# EAGLE design Adafruit Feather 32u4 FONA (EAGLE 6.6.0)
COMPANY: ADAFRUIT INDUSTRIES; DRAWN: KTOWN; REV: B
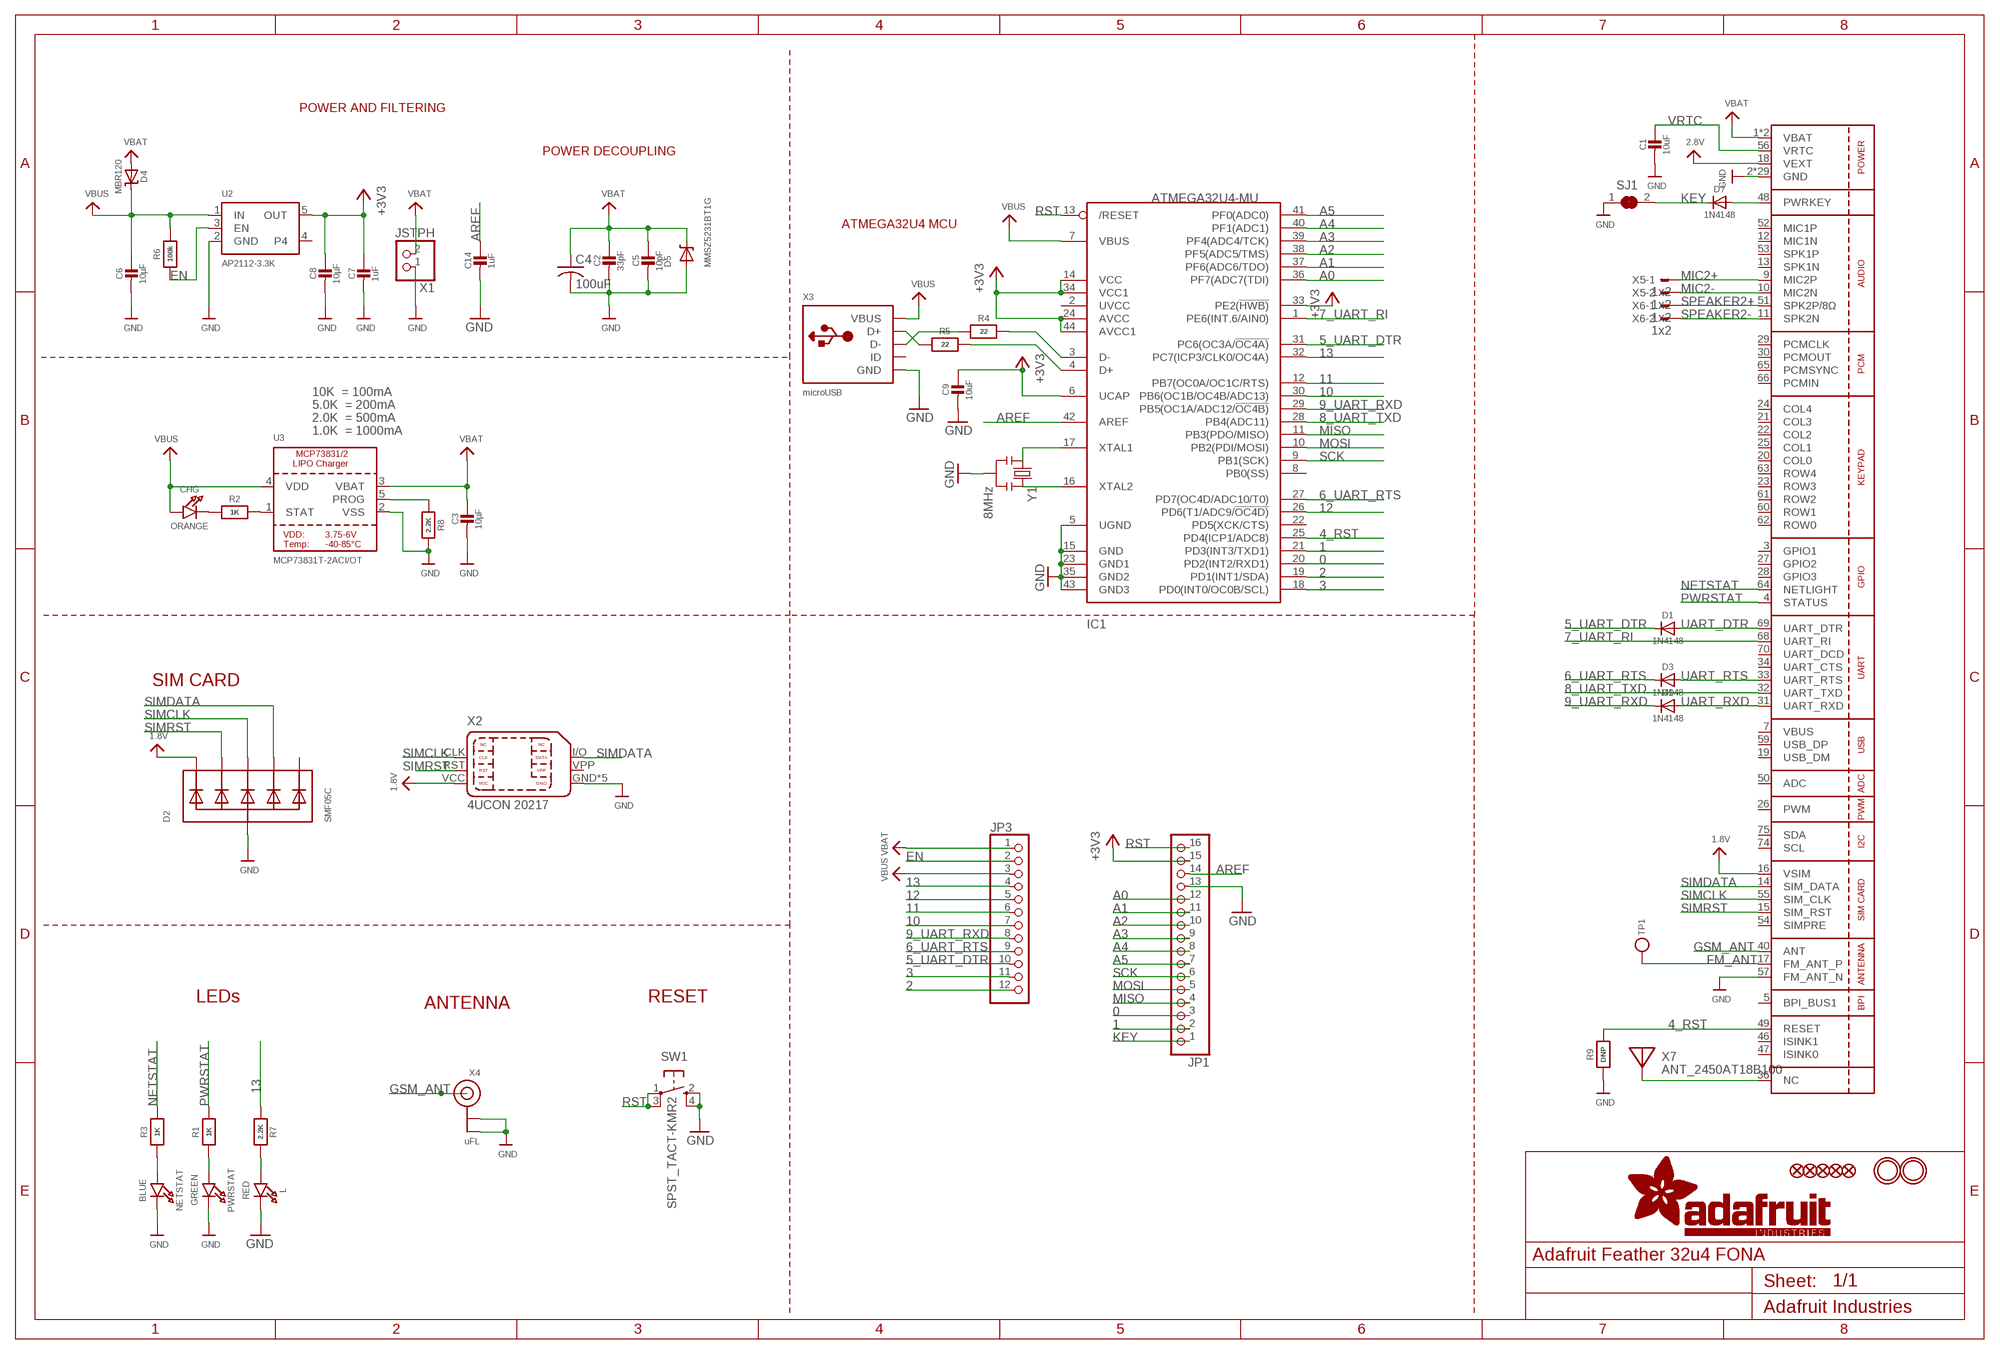
[diagram p0: schematic, sheet 1]

## Parts
C1  10uF  CAP_CERAMIC_0805MP  [_0805MP]
C2  33pF  CAP_CERAMIC0805-NOOUTLINE  [0805-NO]
C3  10µF  CAP_CERAMIC0805-NOOUTLINE  [0805-NO]
C4  100uF  C-USC1210  [C1210]
C5  10pF  CAP_CERAMIC0805-NOOUTLINE  [0805-NO]
C6  10µF  CAP_CERAMIC0805-NOOUTLINE  [0805-NO]
C7  1uF  CAP_CERAMIC0603_NO  [0603-NO]
C8  10µF  CAP_CERAMIC0805-NOOUTLINE  [0805-NO]
C9  10uF  CAP_CERAMIC_0805MP  [_0805MP]
C14  1uF  CAP_CERAMIC0603_NO  [0603-NO]
CHG  ORANGE  LED0805_NOOUTLINE  [CHIPLED_0805_NOOUTLINE]
D1  1N4148  DIODESOD-323  [SOD-323]
D2  SMF05C  TVSARRAY_5LANE  [SOT363]
D3  1N4148  DIODESOD-323  [SOD-323]
D4  MBR120  DIODE-SCHOTTKYSOD-123  [SOD-123]
D5  MMSZ5231BT1G  DIODE-ZENERSOD123  [SOD-123]
D7  1N4148  DIODESOD-323  [SOD-323]
D9  1N4148  DIODESOD-323  [SOD-323]
IC1  ATMEGA32U4-MU  [TQFN44_7MM]
JP1  HEADER-1X16ROUND  [1X16_ROUND]
JP3  HEADER-1X12  [1X12_ROUND]
L  RED  LED0805_NOOUTLINE  [CHIPLED_0805_NOOUTLINE]
NETSTAT  BLUE  LED0805_NOOUTLINE  [CHIPLED_0805_NOOUTLINE]
PWRSTAT  GREEN  LED0805_NOOUTLINE  [CHIPLED_0805_NOOUTLINE]
R1  1K  RESISTOR_0603_NOOUT  [0603-NO]
R2  1K  RESISTOR_0603_NOOUT  [0603-NO]
R3  1K  RESISTOR_0603_NOOUT  [0603-NO]
R4  22  RESISTOR_0603_NOOUT  [0603-NO]
R5  22  RESISTOR_0603_NOOUT  [0603-NO]
R6  100k  RESISTOR_0603_NOOUT  [0603-NO]
R7  2.2K  RESISTOR_0603_NOOUT  [0603-NO]
R8  2.2K  RESISTOR_0603_NOOUT  [0603-NO]
R9  DNP  RESISTOR_0603_NOOUT  [0603-NO]
SJ1  SOLDERJUMPER_CLOSED  [SOLDERJUMPER_CLOSEDWIRE]
SW1  SPST_TACT-KMR2  [KMR2]
TP1  TESTPOINTROUND1.5MM  [TESTPOINT_ROUND_1.5MM]
U1  SIM800H/L  GSM_SIM800L  [SIM800L]
U2  AP2112-3.3K  VREG_SOT23-5  [SOT23-5]
U3  MCP73831T-2ACI/OT  MCP73831/2  [SOT23-5]
U$18  FIDUCIAL""  [FIDUCIAL_1MM]
U$23  FIDUCIAL""  [FIDUCIAL_1MM]
U$31  MOUNTINGHOLE2.5  [MOUNTINGHOLE_2.5_PLATED]
U$32  MOUNTINGHOLE2.5  [MOUNTINGHOLE_2.5_PLATED]
U$34  FIDUCIAL""  [FIDUCIAL_1MM]
U$35  FIDUCIAL""  [FIDUCIAL_1MM]
U$42  FIDUCIAL""  [FIDUCIAL_1MM]
X1  JSTPH  CON_JST_PH_2PIN  [JSTPH2]
X2  4UCON 20217  SIM_MICRO  [4UCONN_20217]
X3  microUSB  USB_MICRO_20329_V2  [4UCONN_20329_V2]
X4  uFL  ANTENNA_U.FL  [U.FL]
X5  1x2  87758-0216  [87758-0216]
X6  1x2  87758-0216  [87758-0216]
X7  ANT_2450AT18B100  ANTENNA_JOHANSON_2450AT18B100  [ANT_2450AT18B100]
Y1  8MHz  RESONATORSMD  [RESONATOR-SMD]

## Nets
0: IC1.20(PD2(INT2/RXD1)) JP1.3
1: IC1.21(PD3(INT3/TXD1)) JP1.2
1.8V: D2.1(C1) U1.16(VSIM) X2.VCC
2: IC1.19(PD1(INT1/SDA)) JP3.12
2.8V: U1.18(VEXT)
3: IC1.18(PD0(INT0/OC0B/SCL)) JP3.11
4_RST: IC1.25(PD4(ICP1/ADC8)) R9.2 U1.49(RESET)
5_UART_DTR: D1.C IC1.31(PC6(OC3A/!OC4A)) JP3.10
6_UART_RTS: D3.C IC1.27(PD7(OC4D/ADC10/T0)) JP3.9
7_UART_RI: IC1.1(PE6(INT.6/AIN0)) U1.68(UART_RI)
8_UART_TXD: IC1.28(PB4(ADC11)) U1.32(UART_TXD)
9_UART_RXD: D9.C IC1.29(PB5(OC1A/ADC12/!OC4B)) JP3.8
10: IC1.30(PB6(OC1B/OC4B/ADC13)) JP3.7
11: IC1.12(PB7(OC0A/OC1C/RTS)) JP3.6
12: IC1.26(PD6(T1/ADC9/!OC4D)) JP3.5
13: IC1.32(PC7(ICP3/CLK0/OC4A)) JP3.4 R7.1
+3V3: C7.1 C8.1 C9.1 IC1.6(UCAP) IC1.14(VCC) IC1.24(AVCC) IC1.33(PE2(!HWB)) IC1.34(VCC1) IC1.44(AVCC1) JP1.15 U2.5(OUT)
A0: IC1.36(PF7(ADC7(TDI)) JP1.12
A1: IC1.37(PF6(ADC6/TDO)) JP1.11
A2: IC1.38(PF5(ADC5/TMS)) JP1.10
A3: IC1.39(PF4(ADC4/TCK)) JP1.9
A4: IC1.40(PF1(ADC1)) JP1.8
A5: IC1.41(PF0(ADC0)) JP1.7
AREF: C14.1 IC1.42(AREF) JP1.14
D+: IC1.4(D+) R5.2
D-: IC1.3(D-) R4.2
EN: JP3.2 R6.1 U2.3(EN)
FM_ANT: TP1.P$1 U1.17(FM_ANT_P)
GND: C1.2 C2.2 C3.2 C4.2 C5.2 C6.2 C7.2 C8.2 C9.2 C14.2 D2.2(A) D5.A IC1.5(UGND) IC1.15(GND) IC1.23(GND1) IC1.35(GND2) IC1.43(GND3) JP1.13 L.C NETSTAT.C PWRSTAT.C R8.2 R9.1 SJ1.1 SW1.2(S) SW1.4(S1) U1.2(GND) U1.6(GND) U1.8(GND) U1.35(GND) U1.37(GND) U1.38(GND) U1.39(GND) U1.41(GND) U1.43(GND) U1.44(GND) U1.45(GND) U1.57(FM_ANT_N) U1.58(GND) U1.67(GND) U1.71(GND) U1.72(GND) U1.73(GND) U1.76(GND) U1.77(GND) U1.78(GND) U1.79(GND) U1.80(GND) U1.81(GND) U1.82(GND) U1.83(GND) U1.84(GND) U1.85(GND) U1.86(GND) U1.87(GND) U1.88(GND) U2.2(GND) U3.2(VSS) X1.1 X2.GND X2.GND@1(GND) X2.GND@2(GND) X2.GND@3(GND) X2.GND@4(GND) X3.BASE@1(GND) X3.BASE@2(GND) X3.GND X3.SPRT@1(GND) X3.SPRT@2(GND) X3.SPRT@3(GND) X3.SPRT@4(GND) X4.1(GND) X4.2(GND) Y1.2
GSM_ANT: U1.40(ANT) X4.3(SIGNAL)
KEY: D7.C JP1.1 SJ1.2
MIC2+: U1.9(MIC2P) X5.1
MIC2-: U1.10(MIC2N) X5.2
MISO: IC1.11(PB3(PDO/MISO)) JP1.4
MOSI: IC1.10(PB2(PDI/MOSI)) JP1.5
N$1: CHG.C R2.1
N$2: L.A R7.2
N$3: R2.2 U3.1(STAT)
N$4: R8.1 U3.5(PROG)
N$5: PWRSTAT.A R1.1
N$6: U1.36(NC) X7.FP
N$7: D7.A U1.48(PWRKEY)
N$9: NETSTAT.A R3.1
N$11: IC1.16(XTAL2) Y1.3
N$12: IC1.17(XTAL1) Y1.1
N$15: R5.1 X3.D+
N$16: R4.1 X3.D-
NETSTAT: R3.2 U1.64(NETLIGHT)
PWRSTAT: R1.2 U1.4(STATUS)
RST: IC1.13(/RESET) JP1.16 SW1.1(P) SW1.3(P1)
SCK: IC1.9(PB1(SCK)) JP1.6
SIMCLK: D2.4(C3) U1.55(SIM_CLK) X2.CLK
SIMDATA: D2.5(C4) U1.14(SIM_DATA) X2.I/O(DATA)
SIMRST: D2.3(C2) U1.15(SIM_RST) X2.RST
SPEAKER2+: U1.51(SPK2P/8Ω) X6.1
SPEAKER2-: U1.11(SPK2N) X6.2
UART_DTR: D1.A U1.69(UART_DTR)
UART_RTS: D3.A U1.33(UART_RTS)
UART_RXD: D9.A U1.31(UART_RXD)
VBAT: C2.1 C3.1 C4.1 C5.1 D4.A D5.C JP3.1 U1.1(VBAT) U1.42(VBAT) U3.3(VBAT) X1.2
VBUS: C6.1 CHG.A D4.C IC1.7(VBUS) JP3.3 R6.2 U2.1(IN) U3.4(VDD) X3.VBUS
VRTC: C1.1 U1.56(VRTC)
Unconnected: D2.6(C5) IC1.2(UVCC) IC1.8(PB0(SS)) IC1.22(PD5(XCK/CTS)) U1.3(GPIO1) U1.5(BPI_BUS1) U1.12(MIC1N) U1.13(SPK1N) U1.19(USB_DM) U1.20(COL0) U1.21(COL3) U1.22(COL2) U1.23(ROW3) U1.24(COL4) U1.25(COL1) U1.26(PWM) U1.27(GPIO2) U1.28(GPIO3) U1.29(PCMCLK) U1.30(PCMOUT) U1.34(UART_CTS) U1.46(ISINK1) U1.47(ISINK0) U1.50(ADC) U1.52(MIC1P) U1.53(SPK1P) U1.54(SIMPRE) U1.59(USB_DP) U1.60(ROW1) U1.61(ROW2) U1.62(ROW0) U1.63(ROW4) U1.65(PCMSYNC) U1.66(PCMIN) U1.70(UART_DCD) U1.74(SCL) U1.75(SDA) U2.4 X2.VPP X3.ID

## Notes on the sheet
- POWER AND FILTERING
- POWER DECOUPLING
- ATMEGA32U4 MCU
- 10K  = 100mA
- 5.0K  = 200mA
- 2.0K  = 500mA
- 1.0K  = 1000mA
- SIM CARD
- LEDs | ANTENNA | RESET

## Power pins joined to a net without a drawn wire
VBUS: U1.7(VBUS)

## Library data of the parts
C1-C3 C5-C9 C14 = microbuilder:CAP_CERAMIC: Ceramic Capacitors For new designs, use the packages preceded by an '_' character since they are more reliable: The following footprints should be used on most boards: _0402 - Standard footprint for regular board layouts _0603 - Standard footprint for regular board layouts _0805 - Standard footprint for regular board layouts _1206 - Standard footprint for regular board layouts For extremely tight-pitch boards where space is at a premium, the following 'micro-pitch' footprints can be used (smaller pads, no silkscreen outline, etc.): _0402MP - Micro-pitch footprint for very dense/compact boards _0603MP - Micro-pitch footprint for very dense/compact boards _0805MP - Micro-pitch footprint for very dense/compact boards _1206MP - Micro-pitch footprint for very dense/compact boards
C4 = rcl:C-US: CAPACITOR, American symbol
CHG L NETSTAT PWRSTAT = microbuilder:LED: LED 0603 - 0603 Surface Mount Package 2mA: Green LED - Low Power (3.9mcd, 2ma, 1.7Vf) - Digikey: 475-2709-2-ND Orange LED - Low Power (9.8mcd, 2ma, 1.8Vf) - Digikey: 475-1194-2-ND Red LED - Low Power (5mcd, 2ma, 1.8Vf) - Digikey: 475-1195-2-ND Yellow LED - Low Power (7mcd, 2ma, 1.8Vf) - Digikey: 475-1196-2-ND 5mA: Blue LED - Low Power (17mcd, 5ma, 2.9Vf) - Digikey: LNJ937W8CRACT-ND 0805 - 0805 Surface Mount Package 2mA: Red LED (8.8mcd, 2mA, 1.8Vf, Clear) - Low Power [Digikey: 475-2510-1-ND] Green LED (5mcd, 2mA, 1.8Vf, Clear) - Low Power [Digikey: 475-2730-1-ND] Yellow LED (11.3mcd, 2mA, 1.8Vf, Clear) - Low Power [Digikey: 475-2555-1-ND] 20mA: Red LED (104mcd, 20mA, Diffused) - LS R976 [Digikey: 475-1278-6-ND] Red LED (12mcd, 20mA, 2.0Vf, Clear) - APT2012EC [Digikey: 754-1128-1-ND] Green LED (15mcd, 20mA, 2.2Vf, Clear) - APT2012GC [Digikey: 754-1131-1-ND] Orange LED (160mcd, 20mA, 2.1Vf, Clear) - APT2012SECK [Digikey: 754-1130-1-ND] 1206 - 1206 Surface Mount Package Green LED (26mcd, 20mA, Diffused) - LG N971 [Digikey: 475-1407-6-ND] Red LED (15mcd, 20mA, Diffused) - LH N974 [Digikey: 475-1416-6-ND] Cree - Cree High-Power Surface Mount LEDs XPEBWT-L1-0000-00D50 - White 111lm 350mA 2.9Vf 6200K 110° XTEAWT-00-0000-00000LEE3 - White 114lm 350mA 2.85Vf 5000K 115° Everlight - Everlight 45-21 Series Surface Mount LEDs 45-21/QK2C-B2832AC2CB2/2T - Warm White 2000mcd 20mA 3.25Vf 3050K 120° 45-21/LK2C-B38452C4CB2/2T - Nuetral White 2000mcd 20mA 3.25Vf 4150K 120° 45-21/LK2C-B50634C6CB2/2T - Cold White 2200mcd 20mA 3.25Vf 5650K 120° PLCC2 Reverse Mount LS T77K-J1L2-1-0-2-R18-Z - Red 11.25mcd 2mA 1.8Vf 630nm 120° LO T77K-L1M2-24-Z - Orange 19.6mcd 2mA 1.8Vf 606nm 120° LY T77K-K2M1-26-Z - Yellow 15.7mcd 2mA 1.8Vf 587nm 120°
D1 D3 D7 D9 = microbuilder:DIODE: Diode SMA Model Volts Amps Type Vf Ir Digikey # Notes SSA34-E3 40V 3A Schottky 480mV @ 3A 200uA @ 40V SSA34-E3/61TGITR-ND CDBA120-G 20V 1A Schottky 500mV @ 1A 500uA @ 20V 641-1014-6-ND REEL MBRA210 10V 2A Schottky 350mV @ 2A 700uA @ 10V MBRA210LT3 SOD-123 Model Volts Amps Type Vf Ir Order # Notes BAT54T1G 30V 200mA Schottky 800mV @ 200mA 2uA @ 25V BAT54T1GOSTR-ND B0530W 30V 500mA Schottky 430mV @ 500mA 130uA @ 30V B0530W-FDICT-ND REEL MBR120 20V 1A Schottky 340mV @ 1A MBR120VLSFT1GOSCT-ND SOD-323 Model Volts Amps Type Vf Ir Order # Notes PMEG2005EJ 20V 500mA Schottky 355mV @ 500mA 568-4110-1-ND ZLLS410 10V 570mA Schottky 380mV @ 570mA ZLLS410CT-ND 1N4148WS 75V 150mA Silicon/Simple 1V 1N4148WSFSCT-ND REEL SOD-523 Model Volts Amps Type Vf Ir Order # Notes BAT54XV2 30V 200mA Schottky 0.8V @ 100mA BAT54XV2CT-ND TB751S 30V 30mA Schottky RB751S-40TE61CT-ND SOT23-R/W (R = Solder Paste/Reflow Ovens, W = Hand-Soldering) Model Volts Amps Type Vf Ir Order # Notes BAT54FILM 40V 300mA Schottky 497-7162-1-ND POWERDI-5 Model Volts Amps Type Vf Ir Order # Notes PDS560 60V 5A Schottky 670mV @ 5A 150uA @ 60V PDS560DICT-ND
D2 = microbuilder:TVSARRAY_5LANE: Voltage Transient Suppressor Array SOT363 SMF05C - 100W 5V: Digikey - SMF05CT1GOSCT-ND
D4 = microbuilder:DIODE-SCHOTTKY
D5 = microbuilder:DIODE-ZENER: Zener Diode SMA: 30V 1W Zener Diode, 1.2Vf - Digikey: SMAZ30-FDICT-ND
IC1 = microbuilder:ATMEGA32U4: http://www.ladyada.net/library/eagle
JP1 = microbuilder:HEADER-1X16: PIN HEADER
JP3 = microbuilder:HEADER-1X12
R1-R9 = microbuilder:RESISTOR: Resistors For new designs, use the packages preceded by an '_' character since they are more reliable: The following footprints should be used on most boards: _0402 - Standard footprint for regular board layouts _0603 - Standard footprint for regular board layouts _0805 - Standard footprint for regular board layouts _1206 - Standard footprint for regular board layouts For extremely tight-pitch boards where space is at a premium, the following 'micro-pitch' footprints can be used (smaller pads, no silkscreen outline, etc.): _0402MP - Micro-pitch footprint for very dense/compact boards _0603MP - Micro-pitch footprint for very dense/compact boards _0805MP - Micro-pitch footprint for very dense/compact boards _1206MP - Micro-pitch footprint for very dense/compact boards
SJ1 = microbuilder:SOLDERJUMPER_CLOSED: Solder Jumper - Closed These solder jumpers are closed by default CLOSEDWIRE - 10 mil trace between pads that can be cut and resoldered later CLOSEDPERM - 63 mil trace between pads for a permanent connection (used to 'bridge' two signals, a shameless hack for Eagle). Can double as a test point as well (no cream layer)
SW1 = adafruit:SPST_TACT: SMT 6mm switch, EVQQ2 series http://www.ladyada.net/library/eagle
TP1 = microbuilder:TESTPOINT: Test Point Various test points for characterisation and PCB testing TESTPOINT_SMT - Compact Surface Mount Test Point [Digikey: 5016KTR-ND]
U1 = microbuilder:GSM_SIM800L: SIM800K Quad-Band GSM/GPRS Module 850/900/1800/1900 MHz Bluetooth EDR (3.0) FM Band: 76-109MHz (50kHz steps) -40 - 85°C
U2 = microbuilder:VREG_SOT23-5: SOT23-5 Fixed Voltage Regulators Part Current Out V Out V In V Dropout θJA (°C/W) TJ (°C) Digikey Part No. ADP121 150mA 3.3V 3.4-5.5V 0.09V @ 150mA -- -- ADP121-AUJZ33R7CT-ND ADP121 150mA 3.0V 3.1-5.5V 0.09V @ 150mA -- -- ADP121-AUJZ30R7CT-ND ADP122 300mA 3.3V 3.4-5.5V 0.085V @ 300mA -- -- ADP122AUJZ-3.3-R7CT-ND ADP1712 300mA 3.3V 3.5-5.5V 0.17V @ 300mA -- -- ADP1712AUJZ-3.3-R7TR-ND AP7311 (Low Cost) 150mA 3.3V 3.5-6V 0.15V @ 150mA -- -- AP7311-33WG-7DICT-ND LD39015M18R 150mA 1.8V 1.9V-5.5V 0.08V @ 100mA -- -- 497-6977-1-ND LP2985A-33DBVR 150mA 3.3V 3.3-16V 0.28V @ 150mA 206 150 296-18479-1-ND MCP1824T-3302E/OT 300mA 3.3V 3.5V-6V 0.2V @ 300mA -- -- MCP1824T-3302E/OTCT-ND MIC5205-2.5YM5 TR 150mA 2.5V 2.7-16V 0.165V @ 150mA -- -- 576-1257-2-ND MIC5205-3.0YM5 TR 150mA 3.0V 3.2V-16V 0.165V @ 150mA -- -- 576-1258-2-ND MIC5205-3.3YM5 TR 150mA 3.3V 3.5V-16V 0.165V @ 150mA -- -- 576-1259-2-ND TPS780330220 150mA 3.3V+2.2V 3.6-5.5V 250mV Max -- -- 296-23332-1-ND TDA3663/N1,135 100mA 3.3V 3.5-45V 0.18V @ 50mA -- -- 568-5343-1-ND Max operating temp can be calculated using θJA, TJ (max junction temperature), and power in watts. Set the "Maximum Ambient Temperature" until it reaches TJ ("Max Junction Temperature"), which is the absolute limit for safe use of the regulator: Heat Sink Temperature Calculator <http://www.daycounter.com/Calculators/Heat-Sink-Temperature-Calculator.phtml> For example, With 12V source into a 3.3V LP2985 and a 30mA load, we are dissipating (12V-3.3V) * 0.03A = 0.261W. With a θJA of 206 °C/W, a TJ of 150°C, and 261mW we can safely use the chip without a heat sink up to 75°C (=147.1°C Junction Temperature).
U3 = microbuilder:MCP73831/2: MCP73831/2 LIPO Charger VDD: 3.75 - 6V Temp -40 - 85°C Programmable Charge Rate: 15-500mA NOTE: STAT is a tri-state logic output on the MCP73831 and an open-drain output on the MCP73832. SOT23-5 with 4.2V output and tri-state logic on STAT = MCP73831T-2ACI/OT
U$18 U$23 U$34 U$35 U$42 = microbuilder:FIDUCIAL: Fiducial Alignment Points Various fiducial points for machine vision alignment.; BOM: EXCLUDE
U$31 U$32 = microbuilder:MOUNTINGHOLE: Mounting Hole For #2 screws (0.086"/2.18mm width, 0.094"/2.4mm hole) use 2.5mm; BOM: EXCLUDE
X1 = microbuilder:CON_JST_PH_2PIN: JST 2-Pin Right-Angle Connector PH-Series - 4UConnector: 17311 SH-Series - 4UConnector: 07278
X2 = microbuilder:SIM_MICRO: Micro SIM Card Holder 78723-1001 = Molex Push/Pull connector (8-Pin)
X3 = microbuilder:USB: USB Connectors USBMINIB - Surface Mount Female Mini-B USB Connector 4UConnector: 06564
X4 = microbuilder:ANTENNA_U.FL: U.FL Antenna Connector
X5 X6 = con-molex:87758-0216: 2 Pin - 2mm Dual Row Single Wafer, Vertical T/H HDR Source: http://www.molex.com/pdm_docs/sd/877580616_sd.pdf; MPN: 87758-0216; OC_FARNELL: unknown; OC_NEWARK: 94M1513
X7 = microbuilder:ANTENNA_JOHANSON_2450AT18B100: Johanson 2.4GHz Chip Antenna (1206 Package) Frequency Range: 2400 - 2500 Mhz Peak Gain 0.5 dBi typ. (XZ-V) Average Gain -0.5 dBi typ. (XZ-V) Input Power 3W max. Operating Temperature -40 to +85°C Digikey: 712-1006-1-ND
Y1 = SparkFun:RESONATOR: Resonator Small SMD resonator. This is the itty bitty 10/20MHz resonators with built in caps. CSTCE10M0G55 and CSTCE20M0V53. Footprint has been reviewed closely but hasn't been tested yet.

## Board
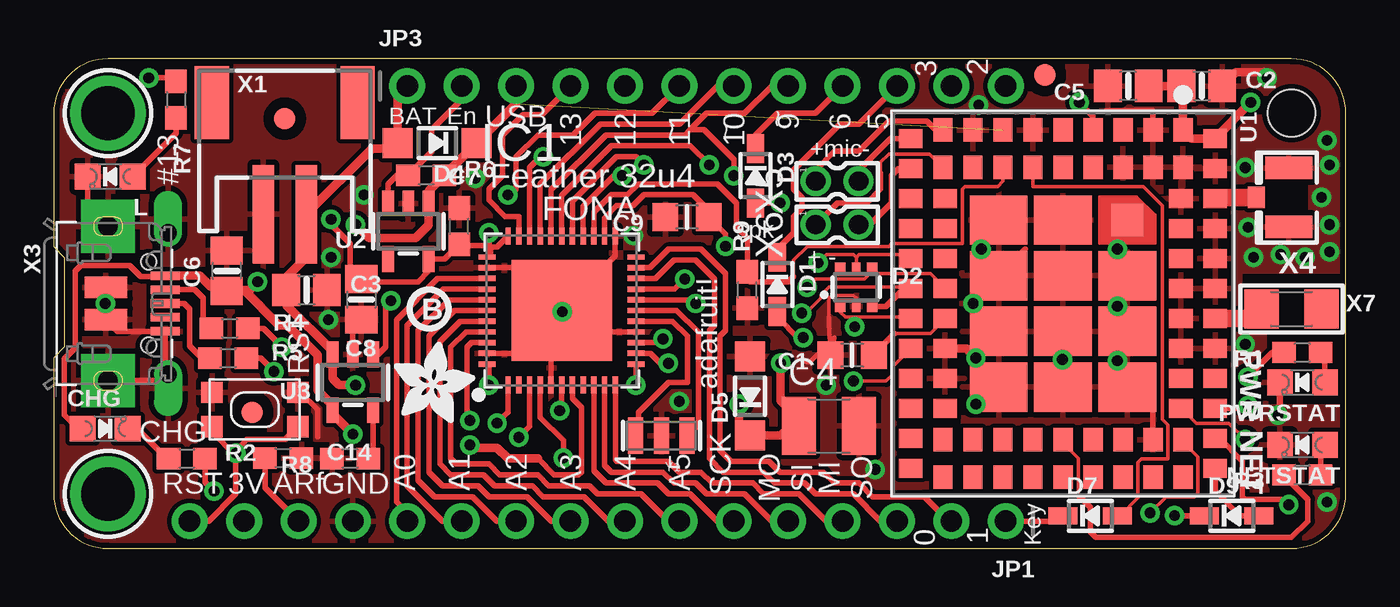
[diagram p1: board, top side]
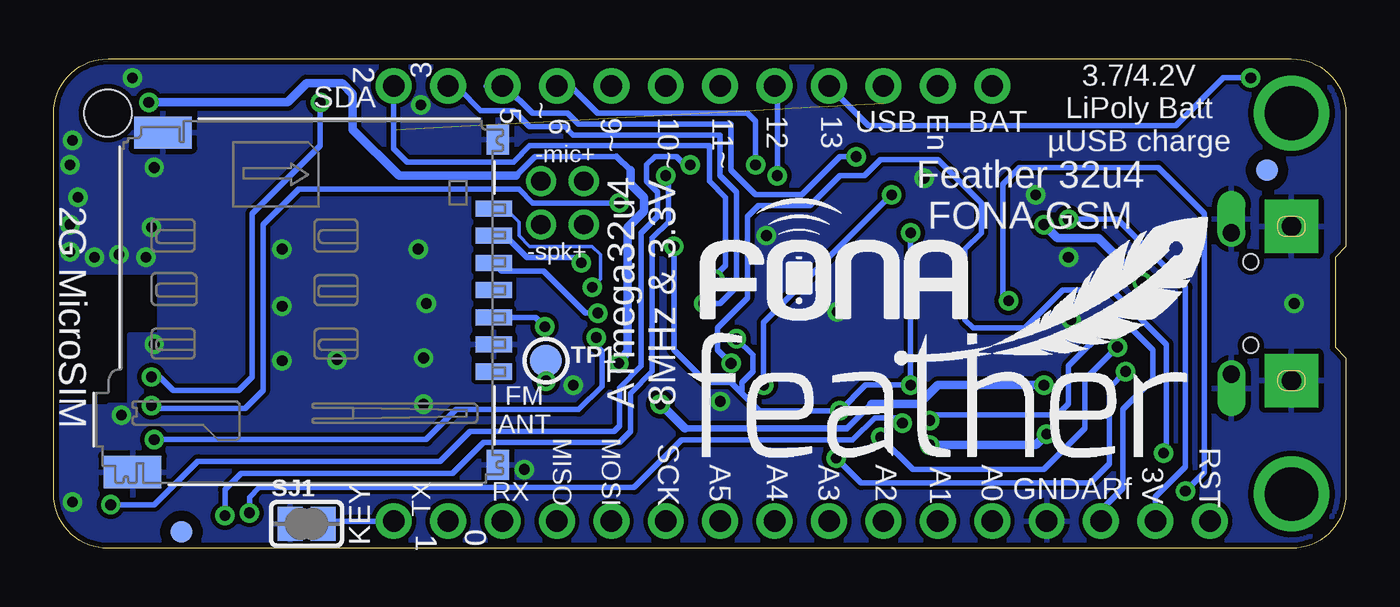
[diagram p2: board, bottom side, seen from below]

Size 60.33 x 22.86 mm. Coordinates in mm from the lower left corner, seen from the top.
Outline: 2.54,0 57.78,0 arc90 60.33,2.54 60.33,20.32 arc90 57.78,22.86 2.54,22.86 arc90 0,20.32 0,14.1 0.51,13.59 0.51,9.4 0,8.89 0,2.54 arc90 2.54,0
Copper layers (1*16): Top 0.035mm / dielectric 1.5mm / Bottom 0.035mm
Design rules "adafruit 6-6 *": minimum track width 6mil, minimum drill 15.5mil, track to track 8mil, track to pad 6mil, pad to pad 8mil, via to via 8mil, smd to smd 8mil, copper to edge 10mil, drill to drill 8mil, minimum pad ring 10mil, minimum via ring 8mil, stop-mask expansion 2mil, vias tented up to drill 20mil, thermal gap 10mil
Holes 2.2 mm at 57.78,20.32
tRestrict: area 23.5,8.1 to 26.4,8.6; area 26.3,8.6 to 26.5,9.9; area 26.3,10.3 to 26.5,13.5; area 21,13.6 to 25.9,14; area 20.8,9.3 to 21.2,12.8; area 21.1,8.1 to 23,8.6; area 20.8,8.4 to 21.2,8.9; area 20.8,13.3 to 21.2,13.7

### Footprints (pad centres in the part's own frame; a part is rotated, then mirrored left to right if it is on the bottom)
_0805MP = smd 1.2 x 1.3: 1 -1.016,0; 2 1.016,0
0805-NO = smd 1.3 x 1.5: 1 -0.95,0; 2 0.95,0
C1210 = smd 1.6 x 2.7: 1 -1.4,0; 2 1.4,0
0603-NO = smd 1.1 x 1: 1 -0.85,0; 2 0.85,0
CHIPLED_0805_NOOUTLINE = smd 1.2 x 1.2: A 0,-1.05; C 0,1.05
SOD-323 = smd 1.35 x 0.8: A 1.27,0; C -1.27,0
SOT363 = smd 0.5 x 0.5: 1 -0.75,-0.9; 3 0.75,-0.9; 4 0.75,0.9; 6 -0.75,0.9 | smd 0.4 x 0.5: 2 0,-0.9; 5 0,0.9
SOD-123 = smd 1.4 x 1.4: A 1.85,0; C -1.85,0
TQFN44_7MM = smd 0.25 x 0.8: 1 -2.5,-3.475; 2 -2,-3.475; 3 -1.5,-3.475; 4 -1,-3.475; 5 -0.5,-3.475; 6 0,-3.475; 7 0.5,-3.475; 8 1,-3.475; 9 1.5,-3.475; 10 2,-3.475; 11 2.5,-3.475; 23 2.5,3.475; 24 2,3.475; 25 1.5,3.475; 26 1,3.475; 27 0.5,3.475; 28 0,3.475; 29 -0.5,3.475; 30 -1,3.475; 31 -1.5,3.475; 32 -2,3.475; 33 -2.5,3.475 | smd 0.8 x 0.25: 12 3.475,-2.5; 13 3.475,-2; 14 3.475,-1.5; 15 3.475,-1; 16 3.475,-0.5; 17 3.475,0; 18 3.475,0.5; 19 3.475,1; 20 3.475,1.5; 21 3.475,2; 22 3.475,2.5; 34 -3.475,2.5; 35 -3.475,2; 36 -3.475,1.5; 37 -3.475,1; 38 -3.475,0.5; 39 -3.475,0; 40 -3.475,-0.5; 41 -3.475,-1; 42 -3.475,-1.5; 43 -3.475,-2; 44 -3.475,-2.5 | smd 4.7 x 4.7: THERMAL 0,0
1X16_ROUND = drill 1 pad 1.676: 1 -19.05,0; 2 -16.51,0; 3 -13.97,0; 4 -11.43,0; 5 -8.89,0; 6 -6.35,0; 7 -3.81,0; 8 -1.27,0; 9 1.27,0; 10 3.81,0; 11 6.35,0; 12 8.89,0; 13 11.43,0; 14 13.97,0; 15 16.51,0; 16 19.05,0
1X12_ROUND = drill 1 pad 1.676: 1 -13.97,0; 2 -11.43,0; 3 -8.89,0; 4 -6.35,0; 5 -3.81,0; 6 -1.27,0; 7 1.27,0; 8 3.81,0; 9 6.35,0; 10 8.89,0; 11 11.43,0; 12 13.97,0
SOLDERJUMPER_CLOSEDWIRE = smd 1.168 x 1.6: 1 -0.762,0; 2 0.762,0 | smd 0.635 x 0.203: WIRE 0,0
KMR2 = smd 1 x 1: 1 2,0.8; 2 2,-0.8; 3 -2,0.8; 4 -2,-0.8
TESTPOINT_ROUND_1.5MM = smd 1.5 x 1.5: P$1 0,0
SIM800L = smd 1.1 x 0.9: 1 -8.1,5.6; 2 -8.1,4.2; 3 -8.1,2.8; 4 -8.1,1.4; 5 -8.1,0; 6 -8.1,-1.4; 7 -8.1,-2.8; 8 -8.1,-4.2; 9 -8.1,-5.6; 22 8.1,-5.6; 23 8.1,-4.2; 24 8.1,-2.8; 25 8.1,-1.4; 26 8.1,0; 27 8.1,1.4; 28 8.1,2.8; 29 8.1,4.2; 30 8.1,5.6; 43 -6.36,5.6; 44 -6.36,4.2; 45 -6.36,2.8; 46 -6.36,1.4; 47 -6.36,0; 48 -6.36,-1.4; 49 -6.36,-2.8; 50 -6.36,-4.2; 51 -6.36,-5.6; 60 6.36,-5.6; 61 6.36,-4.2; 62 6.36,-2.8; 63 6.36,-1.4; 64 6.36,0; 65 6.36,1.4; 66 6.36,2.8; 67 6.36,4.2; 68 6.36,5.6 | smd 0.9 x 1.1: 10 -7.7,-7.1; 11 -6.3,-7.1; 12 -4.9,-7.1; 13 -3.5,-7.1; 14 -2.1,-7.1; 15 -0.7,-7.1; 16 0.7,-7.1; 17 2.1,-7.1; 18 3.5,-7.1; 19 4.9,-7.1; 20 6.3,-7.1; 21 7.7,-7.1; 31 7.7,7.1; 32 6.3,7.1; 33 4.9,7.1; 34 3.5,7.1; 35 2.1,7.1; 36 0.7,7.1; 37 -0.7,7.1; 38 -2.1,7.1; 39 -3.5,7.1; 40 -4.9,7.1; 41 -6.3,7.1; 42 -7.7,7.1; 52 -4.9,-5.5; 53 -3.5,-5.5; 54 -2.1,-5.5; 55 -0.7,-5.5; 56 0.7,-5.5; 57 2.1,-5.5; 58 3.5,-5.5; 59 4.9,-5.5; 69 4.9,5.5; 70 3.5,5.5; 71 2.1,5.5; 72 0.7,5.5; 73 -0.7,5.5; 74 -2.1,5.5; 75 -3.5,5.5; 76 -4.9,5.5 | smd 1.5 x 1.5: 77 -3.9,3 | smd 2.3 x 2.7: 78 -3.9,0; 79 -3.9,-3; 80 -1.3,-3; 81 1.3,-3; 82 3.9,-3; 83 3.9,0; 84 3.9,3; 85 1.3,3; 86 -1.3,3; 87 -1.3,0; 88 1.3,0
SOT23-5 = smd 0.55 x 1.2: 1 -0.95,-1.3; 2 0,-1.3; 3 0.95,-1.3; 4 0.95,1.3; 5 -0.95,1.3
FIDUCIAL_1MM = smd 1 x 1: 1 0,0
MOUNTINGHOLE_2.5_PLATED = drill 2.5 pad 3.2: P$1 0,0
JSTPH2 = smd 1 x 4.6: 1 -1,-3.7; 2 1,-3.7 | smd 1.6 x 3.4: NC1 -3.4,1.5; NC2 3.4,1.5
4UCONN_20217 = smd 0.75 x 1.7: CLK -12.31,16.86; GND -5.96,16.86; I/O -11.04,16.86; RST -9.77,16.86; SW -4.69,16.86; VCC -7.23,16.86; VPP -8.5,16.86 | smd 1.4 x 1.05: GND@1 -15.53,17.06; GND@4 -0.33,17.06 | smd 1.5 x 2.7: GND@2 -15.86,1.42; GND@3 0,0
4UCONN_20329_V2 = smd 1 x 2: BASE@1 -0.75,-2; BASE@2 0.75,-2 | smd 0.4 x 1.35: D+ 0,0.775; D- -0.65,0.775; GND 1.3,0.775; ID 0.65,0.775; VBUS -1.3,0.775 | drill 0.8 pad 1.2 offset: SPRT@1 -3.3,0.9; SPRT@2 3.3,0.9 | drill 0.9 pad 2.5 square: SPRT@3 -3.6,-1.9; SPRT@4 3.6,-1.9 | hole 0.7: -1.95,0; 1.95,0
U.FL = smd 2.2 x 1.05: 1 0,1.375; 2 0,-1.375 | smd 0.8 x 1: 3 1.525,0
87758-0216 = drill 0.9 pad 1.27: 1 0,-1; 2 0,1
ANT_2450AT18B100 = smd 1.6 x 1.8: FP -1.4,0; NC 1.4,0
RESONATOR-SMD = smd 0.7 x 1.7: 1 -1.2,0; 2 0,0; 3 1.2,0

### Placement (x,y rotation side)
C1  37.27,9.02 180 top
C2  53.59,21.59 0 top
C3  11.81,12.06 0 top
C4  36.2,5.71 0 top
C5  50.16,21.59 180 top
C6  8.09,12.96 90 top
C7  18.94,15.04 90 top
C8  14.37,11.62 270 top
C9  29.57,15.46 180 top
C14  10.72,4.22 0 top
CHG  2.41,5.59 270 top
D1  33.78,12.32 270 top
D2  37.47,12.19 0 top
D3  32.77,17.4 270 top
D4  17.91,18.92 180 top
D5  32.51,7.11 90 top
D7  48.39,1.52 0 top
D9  54.99,1.52 0 top
IC1  23.72,11.1 0 top
JP1  25.4,1.27 180 top
JP3  30.48,21.59 0 top
L  2.65,17.36 90 top
NETSTAT  58.29,4.83 90 top
PWRSTAT  58.29,7.75 90 top
R1  58.29,9.14 180 top
R2  6.22,4.19 0 top
R3  58.29,3.43 180 top
R4  8.22,10.27 0 top
R5  8.15,8.88 0 top
R6  17.4,17.42 0 top
R7  5.71,20.95 270 top
R8  13.84,4.19 180 top
R9  32.38,12.06 90 top
SJ1  48.51,1.14 0 bottom
SW1  9.4,6.48 180 top
TP1  37.34,8.76 0 bottom
U1  47.12,11.43 270 top
U2  16.56,14.81 180 top
U3  13.97,7.75 180 top
U$7  [ADAFRUIT_3.5MM]  15.88,5.84 0 top
U$18  9.27,6.35 0 top
U$23  3.68,17.65 0 bottom
U$25  [FEATHERLOGO]  30.73,4.19 0 bottom
U$31  2.54,20.32 270 top
U$32  2.54,2.54 270 top
U$34  10.79,20.07 270 top
U$35  46.28,22.11 270 top
U$42  54.36,0.76 0 bottom
U$43  [FONA_LOGO_SMALL]  30.23,10.54 0 bottom
U$44  [PCBFEAT-REV-040]  17.53,11.18 0 top
X1  10.79,19.3 0 top
X2  56.64,3.56 270 bottom
X3  4.45,11.43 270 top
X4  57.66,16.38 180 top
X5  36.58,17.14 270 top
X6  36.58,15.11 270 top
X7  57.78,11.18 0 top
Y1  28.37,5.26 180 top

### Tracks (layer width: path | path; a pad name or v marks a point on that pad's centre or on a via)
0
  Top 0.254: JP1.3 38.61,1.27 37.34,2.54 35.56,2.54 35.05,3.05 33.66,3.05 33.15,3.56 31.24,3.56 30.61,4.19 30.61,10.16 30.86,10.41 30.86,12.57 29.97,13.46 28.96,13.46 28.1,12.6 IC1.20
1
  Top 0.254: IC1.21 27.83,13.1 28.7,13.97 30.23,13.97 31.37,12.83 31.37,10.16 31.11,9.91 31.11,4.57 31.62,4.06 33.4,4.06 33.91,3.56 35.94,3.56 36.45,3.05 37.59,3.05 38.23,2.41 40.64,2.41 41.78,1.27 JP1.2
1.8V  (via drill 0.5)
  Top 0.152: D2.1 36.72,11.04 36.96,10.79 37.47,10.79 | 37.47,10.79 40.08,10.79 | 37.47,10.79 v37.4,10.35
  Top 0.254: 40.08,10.79 U1.16
  Bottom 0.254: X2.VCC 37.84,10.79 v37.4,10.35
2  (via drill 0.5)
  Top 0.254: IC1.19 28.99,12.1 v29.46,12.57
  Bottom 0.254: 44.58,21.59 JP3.12 44.45,18.67 43.81,18.03 38.86,18.03 38.1,18.8 29.72,18.8 29.72,17.14 28.96,16.38 28.96,13.21 29.46,12.7 v29.46,12.57
3  (via drill 0.5)
  Top 0.254: IC1.18 29.8,11.6 v29.97,11.43
  Bottom 0.254: v29.97,11.43 29.21,11.43 28.45,12.19 28.45,16.64 29.21,17.4 29.21,19.3 36.07,19.3 36.45,19.68 38.1,19.68 38.86,20.45 40.39,20.45 41.4,21.46 41.78,21.46 JP3.11
4_RST
  Top 0.152: 34.54,12.7 34.54,13.46 35.18,14.1 38.99,14.1 39.12,14.22 42.42,14.22 42.42,16.76 42.55,16.89 44.07,16.89 44.32,17.14 U1.49
  Top 0.254: IC1.25 25.22,15.69 26.04,16.51 26.8,16.51 27.3,17.02 30.99,17.02 31.88,16.13 31.88,14.99 32.38,14.48 R9.2 | 32.38,12.83 32.38,12.57 32.51,12.45 34.29,12.45 34.54,12.7
  Top 0.406: R9.2 32.38,12.83
5_UART_DTR  (via drill 0.5)
  Top 0.254: IC1.31 22.22,17.78 22.73,18.29 v22.86,18.29 | JP3.10 37.59,19.81 36.7,19.81 34.54,17.65 34.54,16.76 34.92,16.38 34.92,15.88 34.54,15.49 34.54,14.73 33.78,13.97 D1.C
  Bottom 0.254: v22.86,18.29 23.62,18.29 25.4,16.51 27.56,16.51 28.7,17.65 28.7,19.81 35.81,19.81 36.32,20.32 37.97,20.32 39.24,21.59 JP3.10 40.13,21.59
6_UART_RTS  (via drill 0.5)
  Top 0.254: v27.56,17.91 27.18,18.29 26.29,18.29 24.22,16.22 IC1.27 | JP3.9 35.56,20.32 33.78,20.32 32.77,19.3 D3.C
  Bottom 0.254: JP3.9 36.2,21.59 34.92,20.32 27.94,20.32 27.56,19.94 v27.56,17.91
7_UART_RI  (via drill 0.5)
  Top 0.152: v51.18,1.65 51.94,2.41 53.24,2.41 53.42,2.59 53.42,4.27 52.72,4.96 U1.68
  Top 0.254: IC1.1 21.22,6.34 21.2,6.34 v20.7,5.84
  Bottom 0.254: v20.7,5.84 20.95,6.1 22,6.1 23.04,5.05 31.01,5.05 33.22,2.85 50.72,2.85 51.18,2.39 v51.18,1.65
8_UART_TXD  (via drill 0.5)
  Top 0.254: IC1.28 23.72,16.48 26.04,18.8 29.72,18.8 v30.61,17.91 | U1.32 54.43,5.13 55.5,4.06 55.5,2.41 55.63,2.29 57.28,2.29 57.53,2.03 v57.66,2.03
  Bottom 0.254: v30.61,17.91 30.61,17.65 31.24,18.29 32.26,18.29 32.64,17.91 32.64,17.14 32.13,16.64 32.13,15.49 32.89,14.73 32.89,8.51 33.91,7.49 33.91,5.71 34.16,5.46 40.89,5.46 42.29,4.06 53.59,4.06 55.63,2.03 v57.66,2.03
9_UART_RXD  (via drill 0.5)
  Top 0.254: 29.72,19.56 29.46,19.3 25.78,19.3 23.22,16.74 IC1.29 | 29.72,19.56 30.48,20.32 32.26,20.32 33.53,21.59 JP3.8 | D9.C v52.32,1.52 | v31.75,17.4 31.75,18.16 30.35,19.56 29.72,19.56
  Bottom 0.254: v52.32,1.52 52.32,2.74 51.56,3.5 41.71,3.5 40.26,4.95 33.91,4.95 33.4,5.46 33.4,7.24 32.38,8.26 32.38,14.48 31.62,15.24 31.62,17.27 v31.75,17.4
10
  Top 0.254: JP3.7 30.99,21.59 29.21,19.81 25.53,19.81 22.72,17 IC1.30
11  (via drill 0.5)
  Top 0.254: JP3.6 27.94,20.32 25.27,20.32 24.26,19.3 22.61,19.3 21.59,18.29 21.59,16.76 21.34,16.51 v21.21,16.51 | IC1.12 27.18,8.59 v27.18,7.62
  Bottom 0.254: v21.21,16.51 27.18,10.54 v27.18,7.62
12  (via drill 0.5)
  Top 0.254: v26.54,17.4 26.16,17.4 24.72,15.96 IC1.26
  Bottom 0.254: JP3.5 26.54,21.46 v26.54,17.4
13  (via drill 0.5)
  Top 0.254: JP3.4 22.8,20.26 21.91,20.26 20.95,19.3 20.95,17.4 20.32,16.76 20.32,16.26 21.08,15.49 21.72,15.49 IC1.32 | R7.1 5.55,21.97 v4.45,21.97
  Bottom 0.254: JP3.4 22.29,19.75 7.94,19.75 5.71,21.97 v4.45,21.97
+3V3  (via drill 0.5)
  Top 0.254: IC1.33 20.71,14.07 20.39,14.07 | 20.39,14.07 20.32,14.14 | 20.32,14.14 v20.32,14.73 | IC1.14 28.27,9.6 v28.45,9.78 | IC1.24 25.72,15.43 26.29,16 27.05,16 27.56,16.51 29.84,16.51 30.59,15.77 C9.1 31.37,14.68 v31.37,14.1 | 20.39,14.07 20.39,13.6 IC1.34 | IC1.6 23.72,6.52 v23.62,6.43 | 14.37,12.69 13.84,13.21 13.84,14.22 12.95,15.11 v12.95,15.37 | 14.37,12.69 C8.1 | 20.32,14.14 18.99,14.14 C7.1 18.26,13.51 U2.5 17.51,12.94 17.02,12.45 14.61,12.45 14.37,12.69 | IC1.44 20.32,8.53 v20.32,7.62
  Bottom 0.254: v20.32,14.73 v20.32,7.62 22.43,7.62 v23.62,6.43 27.38,6.43 28.19,7.24 | v28.45,9.78 27.69,9.02 27.69,8.26 28.19,7.75 28.19,7.24 | 28.19,7.24 28.7,7.75 29.84,7.75 31.37,9.27 v31.37,14.1 | JP1.15 8.89,2.41 7.49,3.81 7.49,12.19 10.67,15.37 v12.95,15.37
A0
  Top 0.254: IC1.36 17.94,12.6 16,10.67 16,2.16 16.51,1.65 JP1.12
A1
  Top 0.254: IC1.37 18.2,12.1 16.51,10.41 16.51,2.92 18.16,1.27 JP1.11
A2
  Top 0.254: JP1.10 20.7,1.27 19.56,2.41 17.78,2.41 17.02,3.17 17.02,10.16 18.46,11.6 IC1.38
A3
  Top 0.254: JP1.9 23.24,1.27 22.1,2.41 20.32,2.41 19.81,2.92 18.16,2.92 17.53,3.56 17.53,9.91 18.72,11.1 IC1.39
A4
  Top 0.254: IC1.40 18.98,10.6 18.03,9.65 18.03,3.94 18.54,3.43 20.07,3.43 20.57,2.92 22.35,2.92 22.86,2.41 24.77,2.41 25.91,1.27 JP1.8
A5
  Top 0.254: IC1.41 19.25,10.1 18.54,9.4 18.54,4.19 18.8,3.94 20.32,3.94 20.83,3.43 22.61,3.43 23.11,2.92 25.02,2.92 25.4,2.54 27.43,2.54 28.7,1.27 JP1.7
AREF  (via drill 0.5)
  Top 0.254: IC1.42 19.51,9.6 19.3,9.4 19.3,6.1 v19.43,5.97 | JP1.14 9.87,2.83 C14.1
  Bottom 0.254: JP1.14 11.43,1.78 10.41,2.79 10.41,6.48 9.02,7.87 9.02,9.27 10.16,10.41 11.05,10.41 12.95,8.51 12.95,6.73 13.46,6.22 19.18,6.22 v19.43,5.97
D+  (via drill 0.5)
  Top 0.254: R5.2 9.66,8.88 v10.29,8.26 | IC1.4 22.72,6.11 23.8,5.03 v23.8,4.22
  Bottom 0.254: v23.8,4.22 22.63,3.05 11.94,3.05 11.05,3.94 11.05,7.49 v10.29,8.26
D-  (via drill 0.5)
  Top 0.254: IC1.3 22.22,5.68 v21.72,5.18 | R4.2 9.8,10.27 v10.67,9.4
  Bottom 0.254: v21.72,5.18 20.22,3.68 14.1,3.68 12.19,5.59 12.19,7.87 v10.67,9.4
EN
  Top 0.254: JP3.2 19.05,20.95 17.65,19.56 17.65,18.53 R6.1 16.03,17.42 15.62,17.02 15.62,16.12 U2.3
FM_ANT  (via drill 0.5)
  Top 0.152: U1.17 39.18,8.49 39.18,8.13 38.86,7.81 v37.34,7.81
  Bottom 0.152: v37.34,7.81 TP1.P$1
GND  (via drill 0.5)
  Top 0.152: D2.2 37.47,11.68 37.34,11.81 36.32,11.81 36.2,11.68 36.2,10.79
  Top 0.203: 36.2,10.79 36.2,10.54 C1.2 36.45,9.84 35.31,8.7 35.12,8.7
  Top 0.254: IC1.15 25.08,10.1 23.88,11.3 | IC1.5 23.22,10.52 v23.75,11.05 | IC1.43 22.31,9.1 23.75,10.54 v23.75,11.05 | IC1.35 22.08,13.1 23.88,11.3 | IC1.23 26.22,13.64 23.88,11.3 | L.C 1.59,15.03 X3.SPRT@3 | X3.BASE@2 3,10.13 X3.GND 5.22,8.26 X3.SPRT@2 5.04,7.83 X3.SPRT@4 | 23.88,11.3 23.88,11.18 v23.75,11.05 | U3.2 13.97,10.67 C8.2 | SW1.4 11.52,7.28 12.32,6.48 12.32,5.21 | U1.67 51.32,7.53 U1.84 | 49.15,20.45 51.31,20.45 51.31,19.54 U1.2 | U1.82 43.32,6.73 v43.05,6.73 | U1.80 45.36,13.97
  Top 0.305: 57.24,6.35 PWRSTAT.C
  Top 0.406: C2.2 55.18,22.23 56.52,22.23 | U1.57 42.61,9.33 v43.05,8.89
  other vias: 43.31,13.97 29.21,6.86 38.35,3.68 2.41,11.43 12.95,13.59 27.05,14.61 19.68,17.27 12.83,10.67 14.48,16.51 49.66,8.76 49.66,11.3 49.66,13.97 42.93,11.43 36.07,7.62 59.56,17.91 55.63,17.78 59.56,15.11 56.64,21.97 59.18,16.38 59.44,2.16 57.28,13.72 58.42,13.59 59.56,13.84 59.44,19.05 43.18,20.7 55.63,9.53 47.09,8.81 56.01,13.59 55.75,14.99 57.15,6.22
  pour Top: 0,22.86 0,0 60.45,0 60.45,6.6 56.58,6.6 56.52,9.91 55.37,9.91 55.37,12.95 60.45,12.95 60.45,22.86
  pour Bottom: 0,0 60.71,0 60.83,6.6 57.72,6.6 57.72,6.67 56.77,6.67 56.77,9.97 55.37,9.97 55.37,12.89 60.45,12.89 60.45,22.86 0,22.86
GSM_ANT
  Top 0.254: 54.22,16.38 U1.40
  Top 0.813: X4.3 54.22,16.38
KEY
  Top 0.254: D7.C 46.86,1.27 JP1.1
  Bottom 0.254: SJ1.2 47.62,1.27 JP1.1
MIC2+
  Top 0.254: U1.9 41.18,19.53 40.77,19.94 38.99,19.94 37.59,18.54 36.45,18.54 35.58,17.67 X5.1
MIC2-
  Top 0.254: U1.10 39.07,19.13 37.58,17.64 X5.2
MISO
  Top 0.254: 36.7,1.27 JP1.4 36.07,1.27 34.8,2.54 33.15,2.54 32.64,3.05 30.73,3.05 30.23,3.56 29.21,3.56 28.7,4.06 26.29,4.06 26.23,4.13 IC1.11
MOSI
  Top 0.254: JP1.5 33.53,1.27 32.26,2.54 30.48,2.54 29.97,3.05 28.96,3.05 28.45,3.56 26.04,3.56 25.72,3.87 IC1.10
N$1
  Top 0.254: CHG.C 3.88,5.59 5.27,4.19 R2.1
N$2
  Top 0.254: L.A 5.71,19.38 R7.2
N$3  (via drill 0.5)
  Top 0.254: U3.1 15.14,9.05 15.49,9.4 15.49,11.3 v15.75,11.56 | R2.2 7.07,3.09 v7.49,2.67
  Bottom 0.254: v15.75,11.56 16,11.81 16,17.02 15.24,17.78 8.76,17.78 6.6,15.62 6.6,3.56 v7.49,2.67
N$4
  Top 0.254: U3.5 14.92,4.42 R8.1
N$5
  Top 0.254: R1.1 59.34,9.14 PWRSTAT.A
N$6
  Top 0.813: U1.36 55.94,10.73 X7.FP
N$7
  Top 0.152: U1.48 45.72,16.89 50.88,16.89 51.77,16 51.77,6.02 52.02,5.77 52.02,4.17 50.77,4.17 50.62,4.01 50.62,2.36 49.78,1.52 D7.A
N$9
  Top 0.254: NETSTAT.A 59.14,4.63 R3.1
N$11
  Top 0.254: IC1.16 28.89,10.6 29.59,9.91 29.59,7.75 28.7,7.75 27.3,6.35 27.3,5.13 Y1.3
N$12
  Top 0.254: IC1.17 29.09,11.1 30.1,10.09 30.1,5.79 Y1.1
N$15
  Top 0.254: X3.D+ 6.1,11.43 6.35,11.18 6.35,9.45 6.92,8.88 R5.1
N$16
  Top 0.254: X3.D- 6.59,12.08 6.99,11.68 6.99,10.27 R4.1
NETSTAT
  Top 0.152: U1.64 47.12,4.9 47.83,4.19 47.83,2.46
  Top 0.254: 57.44,3.72 R3.2 57.44,3.39 58.55,2.29 58.55,1.27 57.78,0.51 48.64,0.51 48.39,0.76 48.39,1.91 47.83,2.46
PWRSTAT  (via drill 0.5)
  Top 0.254: v47.88,20.83 47.88,20.45 48.26,20.45 48.52,20.19 U1.4 | R1.2 56.9,9.14 v55.75,8
  Bottom 0.254: 55.75,8.13 v55.75,8 55.37,8 54.74,7.37 51.69,7.37 51.05,8 51.05,15.62 47.88,18.8 v47.88,20.83
RST  (via drill 0.5)
  Top 0.254: 6.48,1.27 JP1.16 7.24,1.27 8.51,2.54 8.51,4.32 | IC1.13 27.86,9.1 28.32,8.64 v28.7,8.64 | SW1.1 7.4,5.43 8.51,4.32 | SW1.3 10.8,5.08 9.02,5.08 8.89,4.95 8.51,4.57 v8.51,4.45 8.51,4.32
  Bottom 0.254: v28.7,8.64 29.34,9.27 29.34,10.29 27.94,11.68 27.94,15.49 27.43,16 25.02,16 23.62,17.4 22.48,17.4 21.72,18.16 19.05,18.16 17.02,16.13 17.02,14.73 17.78,13.97 17.78,10.67 17.4,10.29 14.99,10.29 13.21,12.06 10.92,12.06 8.38,9.53 8.38,4.57 v8.51,4.45
SCK
  Top 0.254: IC1.9 25.22,3.61 25.78,3.05 28.19,3.05 28.7,2.54 29.72,2.54 30.99,1.27 JP1.6
  Bottom 0.254: 31.62,1.4 JP1.6
SIMCLK  (via drill 0.5)
  Top 0.152: U1.55 40.92,12.83 38.48,12.83 D2.4 38.22,12.94 37.85,12.57 35.56,12.57 v35.18,12.19
  Bottom 0.152: v35.18,12.19 34.8,12.57 34.8,13.72 35.18,14.1 38.1,14.1 38.61,14.61 38.61,15.24 39.23,15.87 X2.CLK
SIMDATA  (via drill 0.5)
  Top 0.152: 39.83,13.72 37.59,13.72 37.47,13.59 | 37.47,13.59 D2.5 | 37.47,13.59 37.34,13.72 36.07,13.72 v35.69,13.34
  Top 0.254: 39.83,13.72 U1.14
  Bottom 0.152: 38.99,14.35 39.54,14.35 X2.I/O
  Bottom 0.254: v35.69,13.34 35.94,13.59 38.23,13.59 38.99,14.35
SIMRST  (via drill 0.5)
  Top 0.152: 39.69,12.13 39.63,12.19 36.2,12.19 35.81,11.81 35.81,11.68 35.12,10.99 v34.92,10.99
  Top 0.254: D2.3 38.85,11.29 39.69,12.13 U1.15
  Bottom 0.254: v34.92,10.99 35.5,10.99 37.46,12.95 37.45,12.95 39.41,12.95 X2.RST
SPEAKER2+
  Top 0.152: U1.51 40.89,18.41 38.99,18.41 38.61,18.03 38.61,17.53
  Top 0.254: 38.61,17.53 38.61,16.76 37.97,16.13 36.59,16.13 X6.1
SPEAKER2-
  Top 0.254: U1.11 39.45,17.73 39.12,17.4 39.12,16.13 38.1,15.11 X6.2
UART_DTR  (via drill 0.5)
  Top 0.152: U1.69 52.65,6.53 53.34,5.84 54.86,5.84 v55.63,5.08
  Top 0.254: 33.66,10.92 D1.A 33.78,10.79 34.8,9.78 v34.99,9.84
  Bottom 0.254: 35.05,9.53 34.73,9.21 34.73,7.56 35.81,6.48 41.53,6.48 42.93,5.08 v55.63,5.08 | 35.05,9.53 v34.99,9.84 | 35.18,9.65 35.05,9.53
UART_RTS  (via drill 0.5)
  Top 0.254: v55.75,6.67 55.62,6.53 U1.33 | D3.A 32.89,16 33.02,16.13 v33.91,16.13
  Bottom 0.254: v55.75,6.67 55.62,6.53 51.38,6.53 50.55,7.37 50.55,15.11 48.9,16.76 38.61,16.76 37.97,16.13 v33.91,16.13
UART_RXD
  Top 0.254: U1.31 54.22,2.68 55.37,1.52 D9.A
VBAT  (via drill 0.5)
  Top 0.254: 10.86,11.36 C3.1 10.86,12.64 | C2.1 52.72,21.52 | D5.C 32,5.77 | 35.01,5.84 C4.1 | 15.8,18.67 D4.A | U1.42 54.22,19.16
  Top 0.406: 10.86,11.36 13.02,9.21 U3.3 13.02,7.93 13.34,7.62 v14.1,7.62 | C5.1 C2.1 | U1.42 53.12,19.13 U1.1 52.72,21.52 | D5.C 33.96,5.26 34.54,5.84 C4.1 | 10.86,12.64 11.79,13.57 X1.2 14.86,18.67 15.8,18.67 | v33.94,8.64 33.94,6.91 35.01,5.84 | 32,5.77 v32,6.73 | D4.A 16.06,21.14 JP3.1 | 54.22,19.16 v55.88,20.83
  Bottom 0.254: 38.73,17.4 37.85,18.29 34.04,18.29
  Bottom 0.305: 34.04,18.29 33.4,17.65 | 30.86,5.59 23.29,5.59 22.15,6.73
  Bottom 0.406: v14.1,7.62 19.05,7.62 19.94,6.73 22.15,6.73 | 38.73,17.4 44.2,17.4 46.35,19.56 46.35,21.21 46.86,21.72 48.51,21.72 49.4,20.83 v55.88,20.83 | 30.86,5.59 v32,6.73 | v33.94,8.64 33.53,9.18 33.53,14.99 32.77,15.75 32.77,16.38 33.4,17.02 33.4,17.65
VBUS  (via drill 0.5)  (1 unrouted)
  Top 0.254: IC1.7 24.22,7 24.64,6.58 24.64,3.56 24.51,3.43 23.37,3.43 22.61,4.19 | 7.37,12.19 8.03,12.19 8.03,12.06 | CHG.A 1.14,5.59 0.51,6.22 0.51,8.84 1.02,9.35 1.02,12.95 1.27,13.21 3.56,13.21 4.06,12.7 5.19,12.7 X3.VBUS | 13.02,6.28 U3.4 13.02,6.67 | 7.91,12.06 8.03,12.06 | 8.03,12.06 C6.1 | 19.75,18.92 D4.C
  Top 0.406: 22.61,4.19 21.21,4.19 20.7,4.7 19.56,4.7 v19.43,4.83 | X3.VBUS 6.83,12.73 7.37,12.19 | 8.03,12.06 8.89,12.06 | 8.89,12.06 10.54,10.41 10.92,10.41 12.32,9.02 12.32,7.37 13.02,6.67 | 13.02,6.28 v13.97,5.33 | v9.53,12.45 9.14,12.06 8.89,12.06 | v14.1,15.11 14.73,14.48 16.89,14.48 17.51,15.1 U2.1 17.51,16.69 R6.2 19.75,18.92 | D4.C 21.59,20.76 JP3.3
  Bottom 0.406: v9.53,12.45 11.56,14.48 13.46,14.48 v14.1,15.11 | v13.97,5.33 14.48,4.83 v19.43,4.83
VRTC
  Top 0.152: 39.24,10.03 40.92,10.03 U1.56
  Top 0.203: 38.67,9.46 38.16,9.46 38.04,9.34 38.04,9.02 C1.1
  Top 0.254: 39.24,10.03 38.67,9.46

### Text on the board
tPlace: 3 | 2 | BAT | En | USB | 13 | 12 | 11 | 10 | ~ | 9 | 6 | 5 | ~ | ~ | +mic- | #13 | Feather 32u4 | FONA | spk | + - | RST | adafruit! | PWR | NET | CHG | A0 | A1 | A2 | A3 | A4 | A5 | SCK | RST | 3V | ARf | GND | MO / SI | MI / SO | 0 | 1 | Key
bPlace: 3 | 2 | 2 | 3.7/4.2V / LiPoly Batt / µUSB charge | SDA | BAT | USB | 6 | ~ | 5 | En | 13 | 12 | 11~ | 10~ | 9~ | -mic+ | Feather 32u4 / FONA GSM | -spk+ | ATmega32u4 / 8MHz & 3.3V | 2G MicroSIM | FM / ANT | MOSI | MISO | RST | 3V | ARf | GND | A0 | A1 | A2 | A3 | A4 | A5 | SCK | RX | TX | KEY | 0 | 0 | 1 | 1